# EAGLE design Picobot_10 (EAGLE 6.5.0)
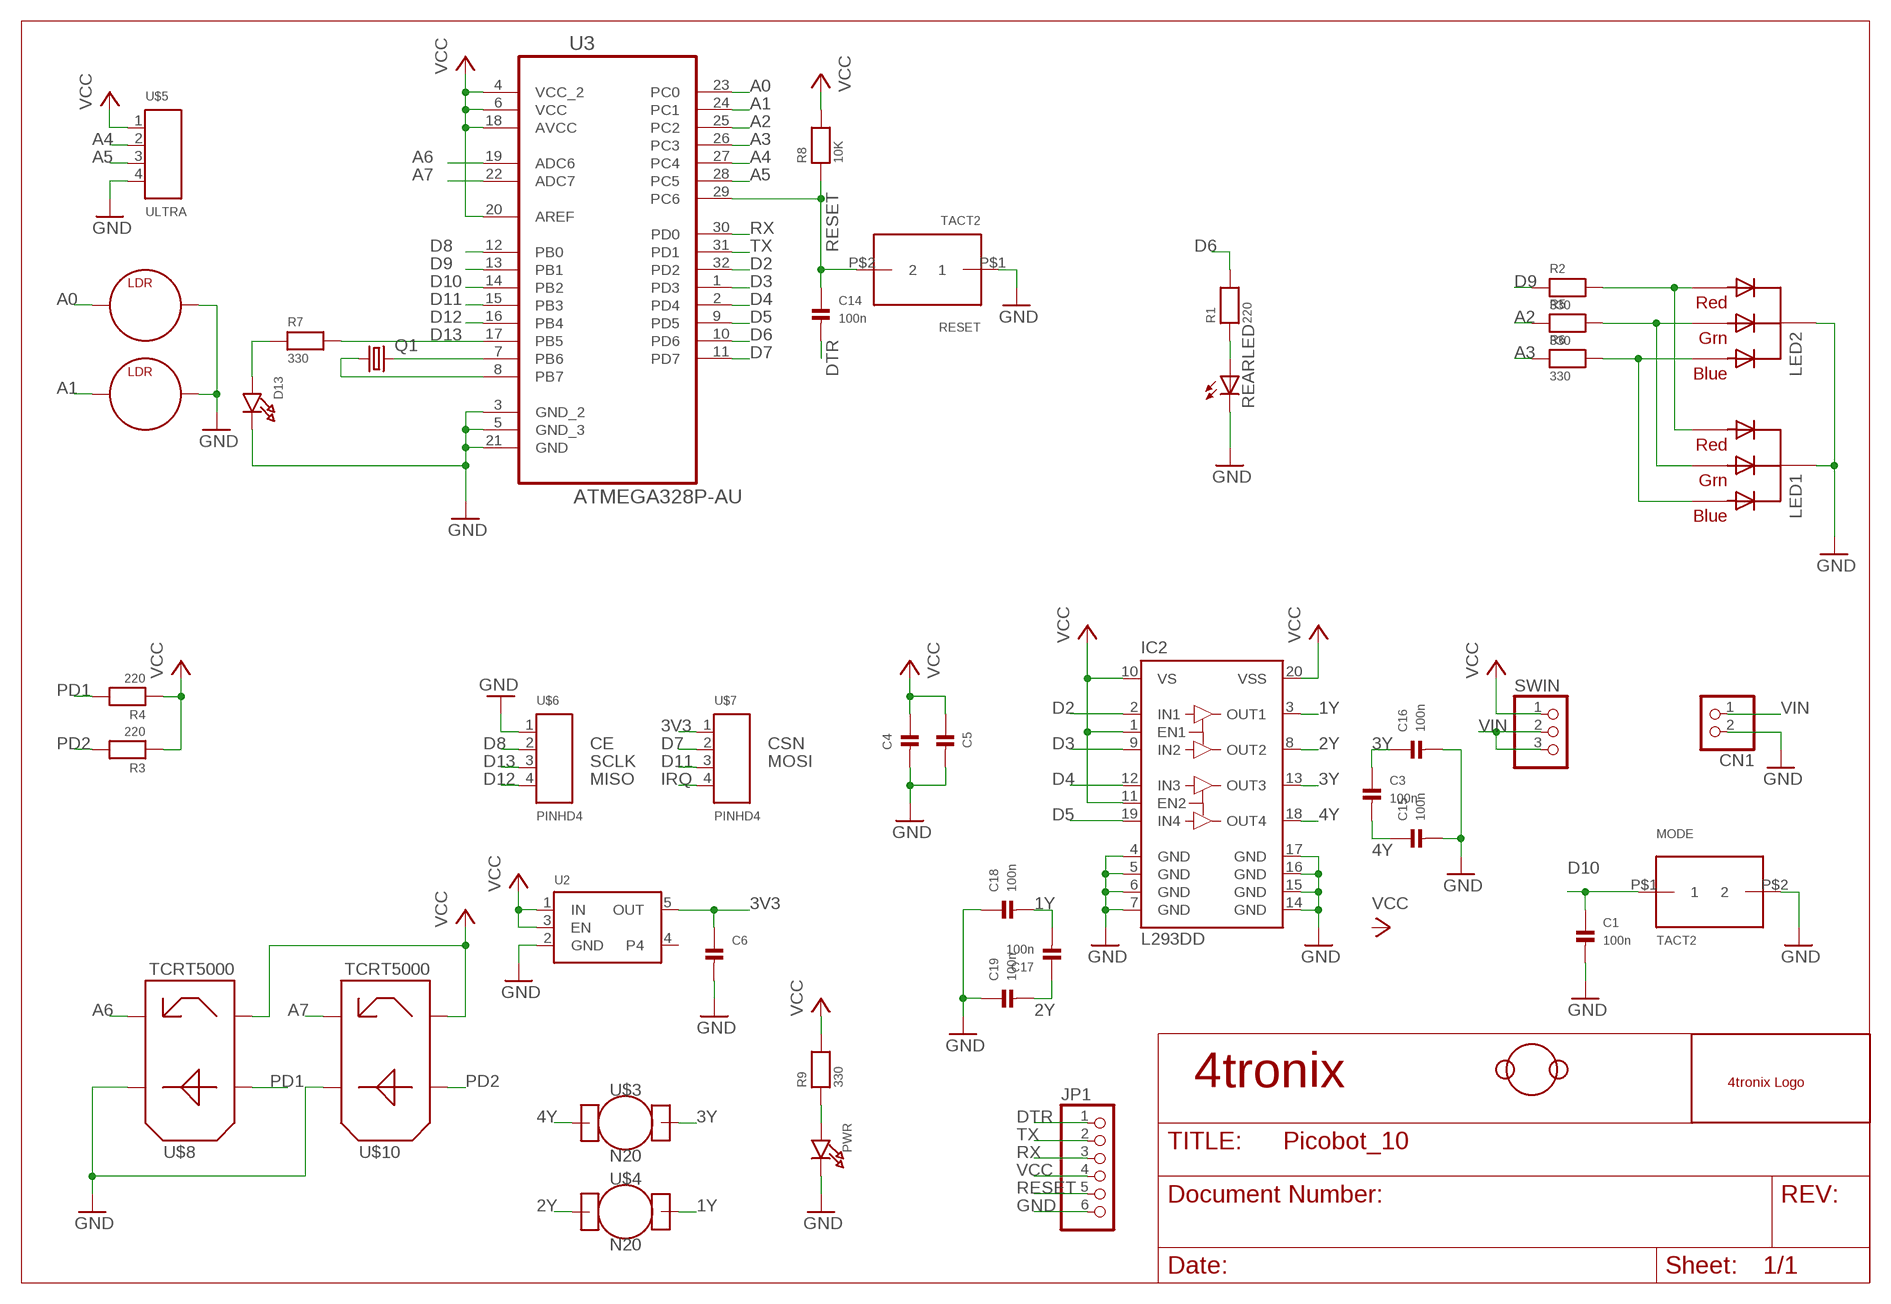
[diagram p0: schematic, sheet 1]

## Parts
C1  100n  CAP_CERAMIC_0805MP  [_0805MP]
C3  100n  CAP_CERAMIC_0805MP  [_0805MP]
C4  CAP_CERAMIC_0805MP  [_0805MP]
C5  CAP_CERAMIC_0805MP  [_0805MP]
C6  CAP_CERAMIC_0805MP  [_0805MP]
C14  100n  CAP_CERAMIC_0805MP  [_0805MP]
C15  100n  CAP_CERAMIC_0805MP  [_0805MP]
C16  100n  CAP_CERAMIC_0805MP  [_0805MP]
C17  100n  CAP_CERAMIC_0805MP  [_0805MP]
C18  100n  CAP_CERAMIC_0805MP  [_0805MP]
C19  100n  CAP_CERAMIC_0805MP  [_0805MP]
CN1  JST_2PIN-THM  [JST-PH-2-THM]
D13  LED0805_NOOUTLINE  [CHIPLED_0805_NOOUTLINE]
IC2  L293DD  [SO20]
JP1  PINHD-1X6CB  [1X06-CLEANBIG]
LDR1  LDR  [LDR]
LDR2  LDR  [LDR]
LED1  RGBLED_CA-5MM  [LED5MMRGB]
LED2  RGBLED_CA-5MM  [LED5MMRGB]
MODE  TACT2  [TACT2-PIN]
PWR  LED0805_NOOUTLINE  [CHIPLED_0805_NOOUTLINE]
Q1  CRYSTALHC49S  [HC49/S]
R1  220  RESISTOR0805_NOTHERMALS  [0805_NOTHERMALS]
R2  330  RESISTOR0805_NOTHERMALS  [0805_NOTHERMALS]
R3  220  RESISTOR0805_NOTHERMALS  [0805_NOTHERMALS]
R4  220  RESISTOR0805_NOTHERMALS  [0805_NOTHERMALS]
R5  330  RESISTOR0805_NOTHERMALS  [0805_NOTHERMALS]
R6  330  RESISTOR0805_NOTHERMALS  [0805_NOTHERMALS]
R7  330  RESISTOR0805_NOTHERMALS  [0805_NOTHERMALS]
R8  10K  RESISTOR0805_NOTHERMALS  [0805_NOTHERMALS]
R9  330  RESISTOR0805_NOTHERMALS  [0805_NOTHERMALS]
REARLED  LED3MM  [LED3MM]
RESET  TACT2  [TACT2-PIN]
SWIN  PINHD-1X3CB  [1X03-CLEANBIG]
U2  VREG_SOT23-5  [SOT23-5]
U3  ATMEGA328P-AU  [QFP80P900X900X120-32N]
U$2  LOGO  [LOGO]
U$3  N20  [N20]
U$4  N20  [N20]
U$5  ULTRA  PINHD4  [PINHD4]
U$6  PINHD4  [PINHD4]
U$7  PINHD4  [PINHD4]
U$8  TCRT5000  [TCRT5000]
U$9  DFRBALL  [DFRBALL]
U$10  TCRT5000  [TCRT5000]

## Nets
1Y: C17.2 C18.2 IC2.3(OUT1) U$4.MTRA(MTRB)
2Y: C17.1 C19.2 IC2.8(OUT2) U$4.MTRB(MTRA)
3V3: C6.1 U2.5(OUT) U$7.1
3Y: C3.1 C16.1 IC2.13(OUT3) U$3.MTRA(MTRB)
4Y: C3.2 C15.1 IC2.18(OUT4) U$3.MTRB(MTRA)
A0: LDR1.A U3.23(PC0)
A1: LDR2.A U3.24(PC1)
A2: R5.1 U3.25(PC2)
A3: R6.1 U3.26(PC3)
A4: U3.27(PC4) U$5.2
A5: U3.28(PC5) U$5.3
A6: U3.19(ADC6) U$8.TR2
A7: U3.22(ADC7) U$10.TR2
D2: IC2.2(IN1) U3.32(PD2)
D3: IC2.9(IN2) U3.1(PD3)
D4: IC2.12(IN3) U3.2(PD4)
D5: IC2.19(IN4) U3.9(PD5)
D6: R1.2 U3.10(PD6)
D7: U3.11(PD7) U$7.2
D8: U3.12(PB0) U$6.2
D9: R2.1 U3.13(PB1)
D10: C1.1 MODE.P$1 U3.14(PB2)
D11: U3.15(PB3) U$7.3
D12: U3.16(PB4) U$6.4
D13: R7.2 U3.17(PB5) U$6.3
DTR: C14.2 JP1.1
GND: C1.2 C4.2 C5.2 C6.2 C15.2 C16.2 C18.1 C19.1 CN1.2 D13.C IC2.4(GND) IC2.5(GND) IC2.6(GND) IC2.7(GND) IC2.14(GND) IC2.15(GND) IC2.16(GND) IC2.17(GND) JP1.6 LDR1.K LDR2.K LED1.2(VCC) LED2.2(VCC) MODE.P$2 PWR.C REARLED.K(C) RESET.P$1 U2.2(GND) U3.3(GND_2) U3.5(GND_3) U3.21(GND) U$5.4 U$6.1 U$8.LED2 U$10.LED2
IRQ: U$7.4
N$1: D13.A R7.1
N$2: R1.1 REARLED.A
N$3: LED1.1(RED) LED2.1(RED) R2.2
N$4: LED1.3(GREEN) LED2.3(GREEN) R5.2
N$5: LED1.4(BLUE) LED2.4(BLUE) R6.2
N$8: PWR.A R9.1
N$11: Q1.2 U3.7(PB6)
N$12: Q1.1 U3.8(PB7)
PD1: R4.2 U$8.LED1
PD2: R3.2 U$10.LED1
RESET: C14.1 JP1.5 R8.1 RESET.P$2 U3.29(PC6)
RX: JP1.3 U3.30(PD0)
TX: JP1.2 U3.31(PD1)
VCC: C4.1 C5.1 IC2.1(EN1) IC2.10(VS) IC2.11(EN2) IC2.20(VSS) JP1.4 R3.1 R4.1 R8.2 R9.2 SWIN.1 U2.1(IN) U2.3(EN) U3.4(VCC_2) U3.6(VCC) U3.18(AVCC) U3.20(AREF) U$5.1 U$8.TR1 U$10.TR1
VIN: CN1.1 SWIN.2 SWIN.3
Unconnected: U2.4

## Notes on the sheet
- CE | CSN
- SCLK | MOSI
- MISO
- 4tronix

## Library data of the parts
C1 C3-C6 C14-C19 = microbuilder:CAP_CERAMIC: Ceramic Capacitors 0402 - 0402 Surface Mount Capacitors 16pF 50V 5% [Digikey: 445-4899-2-ND] 18pF 50V 5% [Digikey: 490-1281-2-ND] 22pF 50V 5% [Digikey: 490-1283-2-ND] 68pF 50V 5% [Digikey: 490-1289-2-ND] 0.1uF 10V 10% [Digikey: 490-1318-2-ND] 1.0uF 6.3V 10% [Digikey: 490-1320-2-ND] 0603 - 0603 Surface Mount Capacitors 16 pF 50V 5% [Digikey: 445-5051-2-ND] 22 pF 50V [Digikey: PCC220ACVTR-ND] 33 pF 50V 5% [Digikey: 490-1415-1-ND] 56pF 50V 5% [Digikey: 490-1421-1-ND] 220pF 50V 5% [Digikey: 445-1285-1-ND] 680 pF 50V 2200 pF 50V 5% C0G [Digikey: 445-1297-1-ND] 5600 pF 100V 5% X7R [Digikey: 478-3711-1-ND] 0.1 µF 25V 10% [Digikey: PCC2277TR-ND] 0.22 µF 16V 10% X7R [Digikey: 445-1318-1-ND] 1.0 µF 25V 10% [Digikey: 445-5146-2-ND] 0603 - RF Specific 3pF 250V +/-0.1pF RF [Digikey: 712-1347-1-ND] 18 pF 250V 5% [Digikey: 478-3505-1-ND or 712-1322-1-ND] 56 pF 250V 5% C0G RF [Digikey: 490-4867-1-ND] 68 pF 250V RF [Digikey: 490-4868-1-ND] 0805 - 0805 Surface Mount Capacitors 220 pF 250V 2% RF Ceramic Capacitor [Digikey: 712-1398-1-ND] 1000 pF 50V 2% NP0 Ceramic Capacitor [Digikey: 478-3760-1-ND] 0.1 µF 25V 10% Ceramic Capacitor [Digikey: PCC1828TR-ND] 1.0 µF 16V 10% Ceramic Capacitor[Digikey: 490-1691-2-ND] 10.0 µF 10V 10% Ceramic Capacitor[Digikey: 709-1228-1-ND] 10.0 uF 16V 10% Ceramic Capacitor [Digikey: 478-5165-2-ND] 47 uF 6.3V 20% Ceramic Capacitor [Digikey: 587-1779-1-ND or 399-5506-1-ND] 1206 - 1206 Surface Mount Capacitors 47uF 10V 20% Ceramic Capacitor [Digikey: 490-5528-1-ND or 399-5508-1-ND or 445-6010-1-ND] 100uF 6.3V -20%, +80% Y5V Ceramic Capacitor (Digikey: 490-4512-1-ND, Mouser: 81-GRM31CF50J107ZE1L)
CN1 = adafruit:JST_2PIN: JST 2-Pin Connectors of various flavors SMT-RA (S2B-PH-SM4) 4UConnector #17311 SMT (B2B-PH-SM4) THM-RA (S2B-PH) THM (B2B-PH)
D13 PWR = microbuilder:LED: LED
IC2 = st-microelectronics:L293DD: PUSH-PULL FOUR CHANNEL DRIVER WITH DIODES Source: http://www.st.com/stonline/books/pdf/docs/1330.pdf; OC_FARNELL: unknown
JP1 = adafruit:PINHD-1X6: PIN HEADER
LDR1 LDR2 = 4tronix:LDR
LED1 LED2 = 4tronix:RGBLED_CA: RGB LED, common-anode 5MM Staggered pins 5mm Piranha package http://www.ladyada.net/library/pcb/eaglelibrary.html
MODE RESET = 4tronix:TACT2
Q1 = crystal:CRYSTAL: CRYSTAL; OC_FARNELL: 1667008; OC_NEWARK: unknown
R1-R9 = microbuilder:RESISTOR: Resistors 0402 - 0402 Surface Mount Package 22 Ohm 1% 1/16W [Digikey: 311-22.0LRTR-ND] 33 Ohm 5% 1/16W 1.0K 5% 1/16W 1.5K 5% 1/16W 2.0K 1% 1/16W 10.0K 1% 1/16W [Digikey: 311-10.0KLRTR-ND] 10.0K 5% 1/16W [Digikey: RMCF0402JT10K0TR-ND] 12.1K 1% 1/16W [Digikey: 311-22.0LRTR-ND] 100.0K 5% 1/16W 0603 - 0603 Surface Mount Package 0 Ohm 1/10 Watt 1% Resistor 15 Ohm 1/10 Watt 1% Resistor 33 Ohm 1/10 Watt 1% Resistor 49.9 Ohm 1/10 Watt 1% Resistor 100 Ohm 1/10 Watt 1% Resistor 150 Ohm 1/10 Watt 1% Resistor 240 Ohm 1/10 Watt 1% Resistor 390 Ohm 1/10 Watt 1% Resistor 560 Ohm 1/10 Watt 1% Resistor 680 Ohm 1/10 Watt 1% Resistor 750 Ohm 1/10 Watt 1% Resistor 1.0K Ohm 1/10 Watt 1% Resistor 1.5K Ohm 1/10 Watt 1% Resistor 2.0K Ohm 1/10 Watt 1% Resistor 2.2K Ohm 1/10 Watt 1% Resistor 3.3K Ohm 1/10 Watt 1% Resistor 4.7K Ohm 1/10 Watt 1% Resistor 10.0K Ohm 1/10 Watt 1% Resistor 12.0K Ohm 1/10 Watt 1% Resistor 12.1K Ohm 1/10 Watt 1% Resistor 20.0K Ohm 1/10 Watt 1% Resistor 33.0K Ohm 1/10 Watt 1% Resistor 100.0K Ohm 1/10 Watt 1% Resistor 0805 - 0805 Surface Mount Package 0 Ohm 1/8 Watt 1% Resistor 33 Ohm 1/8 Watt 1% Resistor 100 Ohm 1/8 Watt 1% Resistor 150 Ohm 1/8 Watt 1% Resistor 200 Ohm 1/8 Watt 1% Resistor 240 Ohm 1/8 Watt 1% Resistor 330 Ohm 1/8 Watt 1% Resistor 390 Ohm 1/8 Watt 1% Resistor 470 Ohm 1/8 Watt 1% Resistor 1.0K Ohm 1/8 Watt 1% Resistor 1.5K Ohm 1/8 Watt 1% Resistor 2.0K Ohm 1/8 Watt 1% Resistor 4.7K Ohm 1/8 Watt 1% Resistor 5.1K Ohm 1/8 Watt 1% Resistor 5.6K Ohm 1/8 Watt 1% Resistor 10.0K Ohm 1/8 Watt 1% Resistor 22.0K Ohm 1/8 Watt 1% Resistor 33.0K Ohm 1/8 Watt 1% Resistor 100K Ohm 1/8 Watt 1% Resistor 1206 - 1206 Surface Mount Package 2012 - 2010 Surface Mount Package 0.11 Ohm 1/2 Watt 1% Resistor - Digikey: RHM.11UCT-ND
REARLED = adafruit:LED: LED
SWIN = adafruit:PINHD-1X3: PIN HEADER
U2 = microbuilder:VREG_SOT23-5: SOT23-5 Fixed Voltage Regulators To better organise some of the SOT23-5 fixed voltage regulators in this library, this new part was created. Part Current Out V Out V In V Dropout Digikey Part No. ADP121 150mA 3.3V 3.4-5.5V 0.09V @ 150mA ADP121-AUJZ33R7CT-ND ADP121 150mA 3.0V 3.1-5.5V 0.09V @ 150mA ADP121-AUJZ30R7CT-ND ADP122 300mA 3.3V 3.4-5.5V 0.085V @ 300mA ADP122AUJZ-3.3-R7CT-ND ADP1712 300mA 3.3V 3.5-5.5V 0.17V @ 300mA ADP1712AUJZ-3.3-R7TR-ND AP7311 (Low Cost) 150mA 3.3V 3.5-6V 0.15V @ 150mA AP7311-33WG-7DICT-ND LD39015M18R 150mA 1.8V 1.9V-5.5V 0.08V @ 100mA 497-6977-1-ND MCP1824T-3302E/OT 300mA 3.3V 3.5V-6V 0.2V @ 300mA MCP1824T-3302E/OTCT-ND MIC5205-2.5YM5 TR 150mA 2.5V 2.7-16V 0.165V @ 150mA 576-1257-2-ND MIC5205-3.0YM5 TR 150mA 3.0V 3.2V-16V 0.165V @ 150mA 576-1258-2-ND MIC5205-3.3YM5 TR 150mA 3.3V 3.5V-16V 0.165V @ 150mA 576-1259-2-ND TPS780330220 150mA 3.3V+2.2V 3.6-5.5V 250mV Max 296-23332-1-ND TDA3663/N1,135 100mA 3.3V 3.5-45V 0.18V @ 50mA 568-5343-1-ND
U3 = Atmel_By_element14_Batch_1-00:ATMEGA328P-AU: 8-bit Microcontroller with In-System Programmable Flash; MPN: ATMEGA328P-AU; OC_FARNELL: 1715486; OC_NEWARK: 14R4631; PACKAGE: TQFP-32; SUPPLIER: Atmel
U$2 = 4tronix:LOGO
U$3 U$4 = 4tronix:N20
U$5-U$7 = 4tronix:PINHD4
U$8 U$10 = 4tronix:TCRT5000
U$9 = 4tronix:DFRBALL

## Board
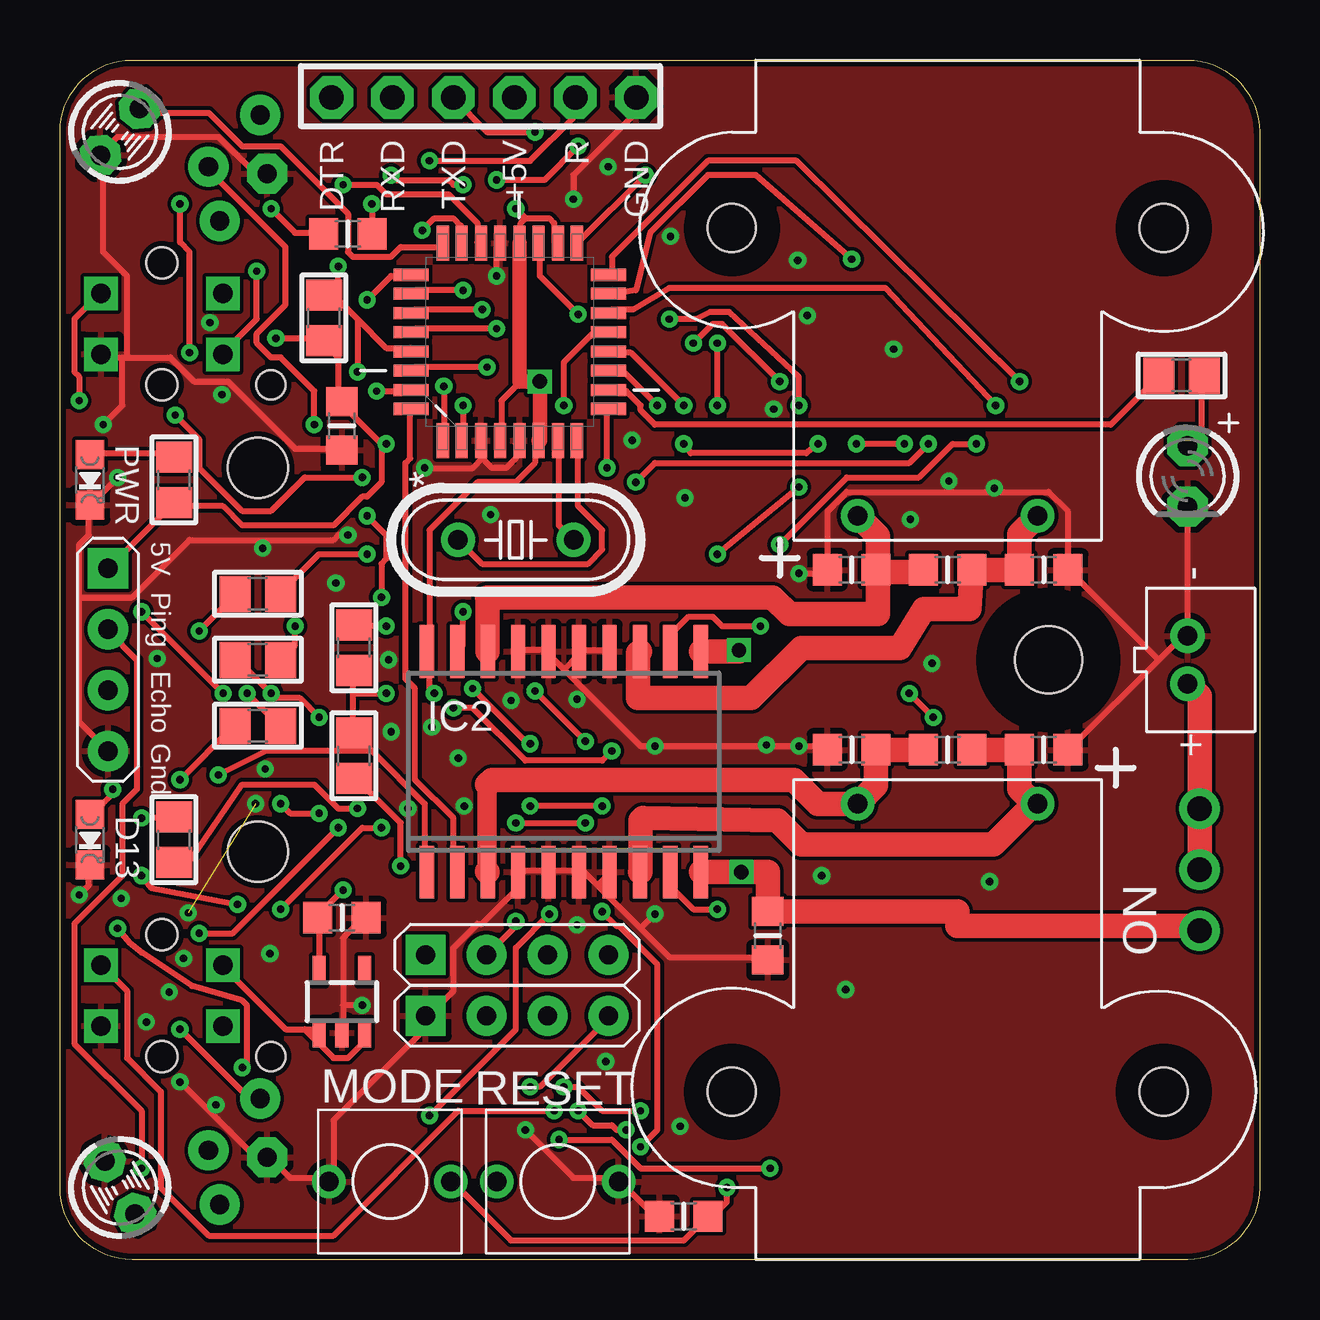
[diagram p1: board, top side]
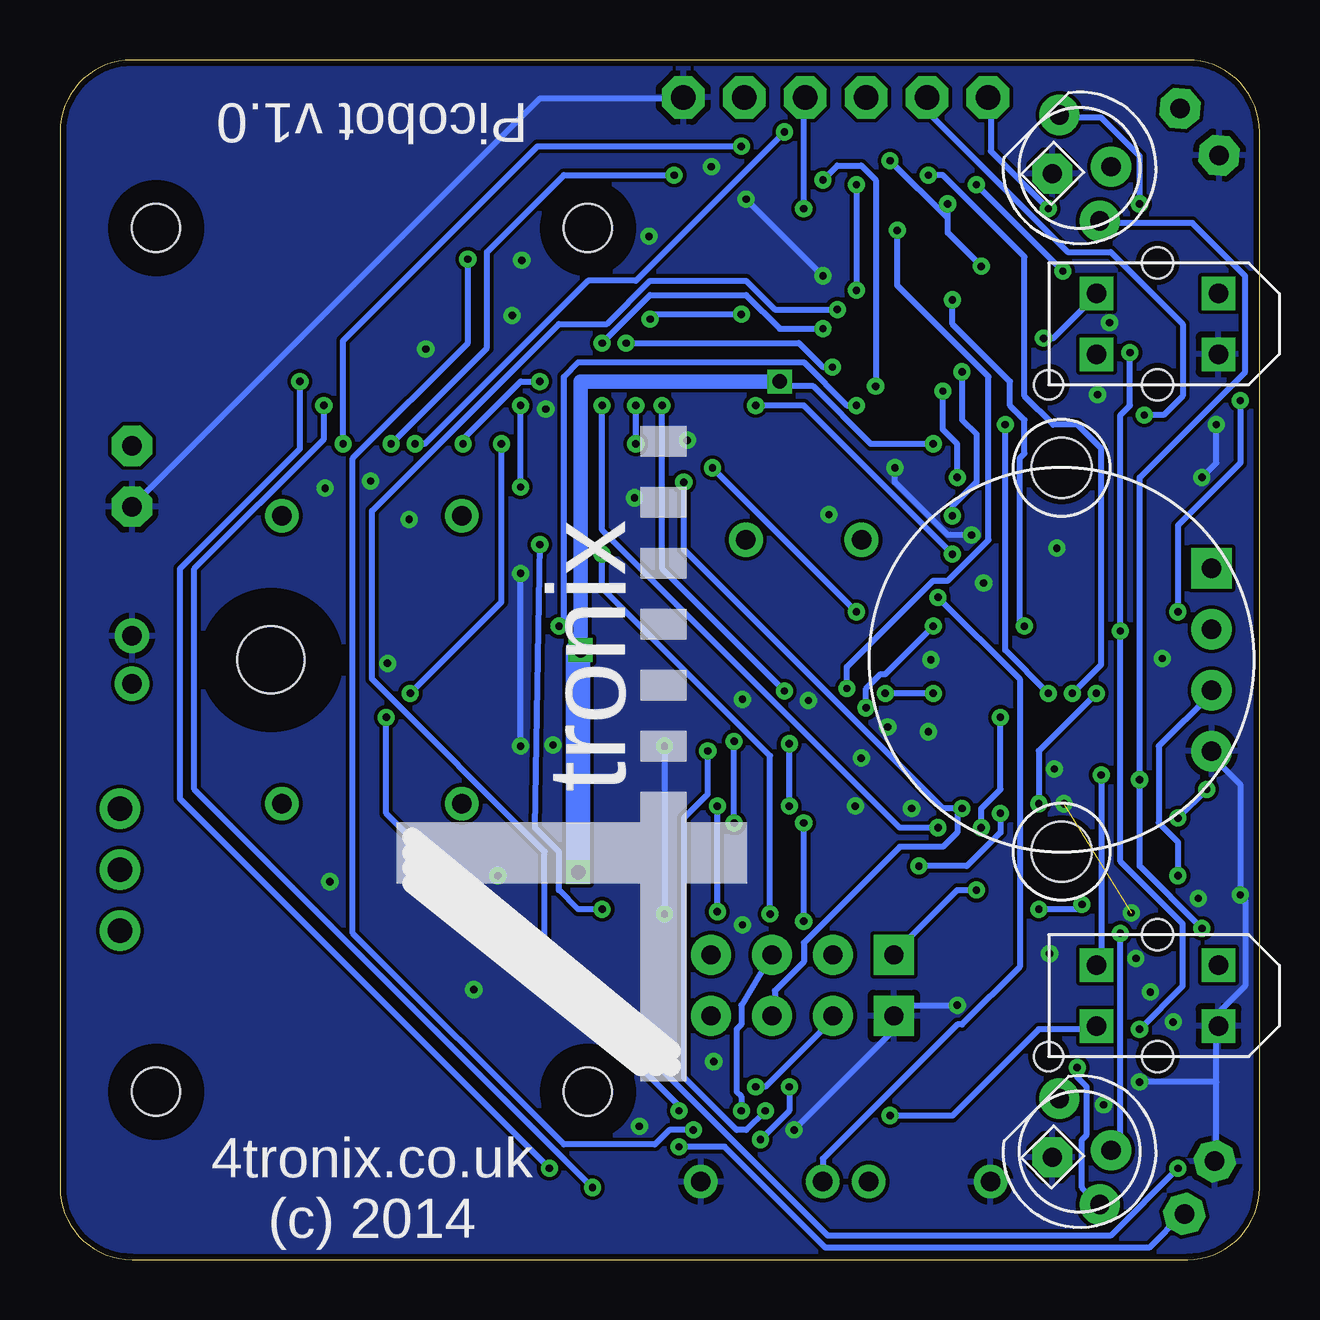
[diagram p2: board, bottom side, seen from below]

Size 50 x 50 mm. Coordinates in mm from the lower left corner, seen from the top.
Outline: 0,3 0,47 arc-90 3,50 47,50 arc-90 50,47 50,3 arc-90 47,0 3,0 arc-90 0,3
Copper layers (1*16): Top 0.035mm / dielectric 1.5mm / Bottom 0.035mm
Design rules "DFRobot_Eagle_Rule_v0.4 *": minimum track width 10mil, minimum drill 12mil, track to track 6mil, track to pad 6mil, pad to pad 6mil, via to via 6mil, smd to smd 0mil, copper to edge 10mil, drill to drill 10mil, minimum pad ring 12mil, minimum via ring 8mil, stop-mask expansion 2mil, vias tented up to drill 25mil, thermal gap 10mil
Holes 2.8 mm at 41.2,25
tRestrict: area 39.2,23 to 43.2,27
bRestrict: area 39.2,23 to 43.2,27

### Footprints (pad centres in the part's own frame; a part is rotated, then mirrored left to right if it is on the bottom)
_0805MP = smd 1.2 x 1.3: 1 -1.016,0; 2 1.016,0
JST-PH-2-THM = drill 0.8 pad 1.422: 1 1,0; 2 -1,0
CHIPLED_0805_NOOUTLINE = smd 1.2 x 1.2: A 0,-1.05; C 0,1.05
SO20 = smd 0.6 x 2.2: 1 -5.715,-4.6; 2 -4.445,-4.6; 3 -3.175,-4.6; 4 -1.905,-4.6; 5 -0.635,-4.6; 6 0.635,-4.6; 7 1.905,-4.6; 8 3.175,-4.6; 9 4.445,-4.6; 10 5.715,-4.6; 11 5.715,4.6; 12 4.445,4.6; 13 3.175,4.6; 14 1.905,4.6; 15 0.635,4.6; 16 -0.635,4.6; 17 -1.905,4.6; 18 -3.175,4.6; 19 -4.445,4.6; 20 -5.715,4.6
1X06-CLEANBIG = drill 1.016 pad 1.778 octagon: 1 -6.35,0; 2 -3.81,0; 3 -1.27,0; 4 1.27,0; 5 3.81,0; 6 6.35,0
LDR = drill 0.813 pad 1.676 octagon: A -1.27,0; K 1.27,0
LED5MMRGB = drill 0.8 pad 1.676: 1 -2.159,0.968; 3 0.889,0.968; 4 2.159,-0.968 | drill 0.8 pad 1.676 octagon: 2 -0.635,-0.968
TACT2-PIN = drill 0.8: P$1 -2.54,0; P$2 2.54,0
HC49/S = drill 0.813: 1 -2.413,0; 2 2.413,0
0805_NOTHERMALS = smd 1.3 x 1.5: 1 -0.95,0; 2 0.95,0
LED3MM = drill 0.813 pad 1.676 octagon: A -1.27,0; K 1.27,0
1X03-CLEANBIG = drill 1.016 pad 1.676: 1 -2.54,0; 2 0,0; 3 2.54,0
SOT23-5 = smd 0.55 x 1.2: 1 -0.95,-1.3; 2 0,-1.3; 3 0.95,-1.3; 4 0.95,1.3; 5 -0.95,1.3
QFP80P900X900X120-32N = smd 1.473 x 0.508: 1 -4.115,2.794; 2 -4.115,2.007; 3 -4.115,1.194; 4 -4.115,0.406; 5 -4.115,-0.406; 6 -4.115,-1.194; 7 -4.115,-2.007; 8 -4.115,-2.794; 17 4.115,-2.794; 18 4.115,-2.007; 19 4.115,-1.194; 20 4.115,-0.406; 21 4.115,0.406; 22 4.115,1.194; 23 4.115,2.007; 24 4.115,2.794 | smd 0.508 x 1.473: 9 -2.794,-4.115; 10 -2.007,-4.115; 11 -1.194,-4.115; 12 -0.406,-4.115; 13 0.406,-4.115; 14 1.194,-4.115; 15 2.007,-4.115; 16 2.794,-4.115; 25 2.794,4.115; 26 2.007,4.115; 27 1.194,4.115; 28 0.406,4.115; 29 -0.406,4.115; 30 -1.194,4.115; 31 -2.007,4.115; 32 -2.794,4.115
N20 = drill 0.8: MTRA 3.75,-12; MTRB -3.75,-12 | hole 2: -9,0; 9,0
PINHD4 = drill 0.8 pad 1.676 square: 1 0,3.81 | drill 0.8 pad 1.676: 2 0,1.27; 3 0,-1.27; 4 0,-3.81
TCRT5000 = drill 0.8 square: LED1 2.54,1.27; LED2 2.54,-1.27; TR1 -2.54,1.27; TR2 -2.54,-1.27 | hole 1.3: 0,2.54; 0,-2.54 | hole 1.2: -4.54,-2.54
DFRBALL = hole 2.5: -8,0; 8,0

### Placement (x,y rotation side)
C1  26,1.8 180 top
C3  37,28.75 180 top
C4  29.5,13.5 270 top
C5  11.75,34.75 270 top
C6  11.75,14.25 0 top
C14  12,42.75 180 top
C15  33,28.75 180 top
C16  41,28.75 0 top
C17  37,21.25 180 top
C18  33,21.25 0 top
C19  41,21.25 180 top
CN1  47,25 270 top
D13  1.25,17.5 180 top
IC2  21,20.75 0 top
JP1  17.67,48.44 0 top
LDR1  2.5,3 120 top
LDR2  2.5,47 230 top
LED1  7.5,4.5 315 bottom
LED2  7.5,45.5 315 bottom
MODE  13.75,3.25 180 top
PWR  1.25,32.5 180 top
Q1  19,30 0 top
R1  46.75,36.85 180 top
R2  8.25,27.75 180 top
R3  12.25,21 270 top
R4  12.25,25.5 90 top
R5  8.25,25 180 top
R6  8.25,22.25 180 top
R7  4.75,17.5 270 top
R8  11,39.25 270 top
R9  4.75,32.5 270 top
REARLED  47,32.65 270 top
RESET  20.75,3.25 180 top
SWIN  47.5,16.25 90 top
U2  11.75,10.75 0 top
U3  18.75,38.25 90 top
U$2  25.8,23.3 90 bottom
U$3  37,43 0 top
U$4  37,7 180 top
U$5  2,25 0 top
U$6  19.05,10.16 90 top
U$7  19.05,12.7 90 top
U$8  4.25,11 0 bottom
U$9  8.25,25 90 bottom
U$10  4.25,39 0 bottom

### Tracks (layer width: path | path; a pad name or v marks a point on that pad's centre or on a via)
1Y
  Top 0.813: 17.8,16.18 17.8,19.8
  Top 1.016: IC2.3 17.8,16.18 | 17.8,19.8 18,20 30.6,20 31.6,19 U$4.MTRA 34.02,19.77 C18.2 C17.2
2Y
  Top 1.016: IC2.8 24.2,16.15 24.2,18.3 24.3,18.4 29.9,18.3 30.9,17.3 38.9,17.3 40.6,19 | 40.6,19 U$4.MTRB | 40.6,19 39.98,19.62 C19.2 C17.1
3V3  (via drill 0.3)
  Top 0.254: U2.5 10.8,14.2 C6.1 10.8,14.4 v11.8,15.4
  Bottom 0.254: v11.8,15.4 12.6,15.4 15.2,12.8 U$7.1
3Y
  Top 1.016: IC2.13 24.1,25.27 24.1,23.4 28.8,23.4 30.9,25.5 35,25.5 36,27.12 37.92,27.12 C3.1 C16.1 39.98,30.23 U$3.MTRA
4Y
  Top 1.016: IC2.18 17.82,27.57 17.8,27.6 29.7,27.6 30.4,26.9 34.1,26.9 34.1,28.67 | 34.1,28.67 C15.1 | 34.1,28.67 34.1,30.15 U$3.MTRB | 34.1,28.67 35.9,28.67 C3.2
A0  (via drill 0.3)
  Top 0.254: v15.1,42.9 15.6,43.4 16.4,43.4 16.7,43.1 16.7,42.4 U3.23 | v17.2,23.8 19.5,21.5 v19.6,21.5 | v22.6,18.9 v19.6,18.9 | v22.6,14.5 23.2,13.9 23.3,13.9 24.9,12.3 24.9,5.4 v24.2,4.7
  Bottom 0.254: v15.1,42.9 15.1,40.6 11.3,36.8 11.3,30 13,28.3 13.6,28.3 17.2,24.7 v17.2,23.8 | v19.6,18.9 v19.6,21.5 | v22.6,14.5 v22.6,18.9 | v24.2,4.7 22.3,4.7 18.1,0.5 4.6,0.5 3.2,1.9 LDR1.A
A1
  Top 0.254: U3.24 15.8,42.2 14.2,42.2 13.8,41.8 12.2,41.8 12,42 12,43.6 9.2,46.4 7.6,46.4 6.2,47.8 3.4,47.8 LDR2.A
A2  (via drill 0.3)
  Top 0.254: v12.8,40 13.8,41 14.6,41 U3.25 | v9.8,26.4 9.8,25.6 R5.1
  Bottom 0.254: v12.8,40 12.8,39 10.4,36.6 10.4,35.6 9.8,35 9.8,33.6 10,33.4 10,26.6 v9.8,26.4
A3  (via drill 0.3)
  Top 0.254: v16.8,40.4 14.8,40.4 U3.26 | v16.8,44.8 16.4,44.8 16.2,45 14,45 v13.8,45.2 | v7.8,23.6 9.2,22.2 R6.1
  Bottom 0.254: v16.8,44.8 v16.8,40.4 | v13.8,45.2 13.2,45.2 9.8,41.8 9.8,36 8.6,34.8 7.6,34.8 6.6,33.8 6.6,24.8 v7.8,23.6
A4  (via drill 0.3)
  Top 0.254: v17.6,39.6 14.8,39.6 U3.27 | v3.4,3.8 3.4,6.2 0.6,9 0.6,14 2.6,16 2.6,19 3.2,19.6 3.2,25 2,26.2 U$5.2
  Bottom 0.254: v17.6,39.6 20.2,39.6 21.4,40.8 25.4,40.8 27.2,39 29.2,39 37,31.2 37,24.2 29.8,17 29.8,12.8 18,1 6.2,1 v3.4,3.8
A5  (via drill 0.3)
  Top 0.254: v18.2,38.8 14.8,38.8 U3.28 | v27.4,35.6 v27.4,38.2 | v13.4,18 12.6,18 v9.2,14.6 | v7.4,14.8 3.8,15.5 v3.4,16
  Bottom 0.254: v18.2,38.8 20,38.8 21.4,40.2 25.4,40.2 v27.4,38.2 | v27.4,35.6 27.4,30.4 15,18 v13.4,18 | v9.2,14.6 7.6,14.6 v7.4,14.8 | v3.4,16 3.4,17.4 4.2,18.2 4.2,21.4 2,23.6 U$5.3
A6  (via drill 0.3)
  Top 0.254: v21.6,39.4 20,41 20,42.2 U3.19 | v25.4,39.2 26.5,39.2 27.1,39.5 27.9,39.5 30.8,36.8 v30.8,35.6 | v27.4,29.4 v30.8,32.2 | v20.4,14.4 19,13 19,9.6 v15.4,6
  Bottom 0.254: v21.6,39.4 25.2,39.4 v25.4,39.2 | v30.8,32.2 v30.8,35.6 | v27.4,29.4 27.4,28 20.4,21 v20.4,14.4 | v15.4,6 12.8,6 9.2,9.6 6.8,9.6 U$8.TR2
A7  (via drill 0.3)
  Top 0.254: v11.8,44.8 13.2,44.8 13.6,44.4 16.2,44.4 17.4,43.2 17.4,42.4 U3.22 | v8.2,41.2 8.2,39.2 6.8,37.8 U$10.TR2
  Bottom 0.254: v8.2,41.2 v11.8,44.8
D2
  Top 0.254: U3.32 14.6,35.4 14.6,33.4 14.4,33.2 14.4,24.2 14.8,23.8 14.8,20 16.4,18.4 16.4,16.2 IC2.2
D3  (via drill 0.3)
  Top 0.254: v16,36.4 16,34.2 U3.1 | v18.2,45 20.2,45 v21.6,46.4 | v38.2,34 37.2,34 35.8,32.6 32.8,32.6 v30,29.8 | v27.4,14.6 26.4,14.6 25.6,15.4 25.6,16 IC2.9
  Bottom 0.254: v16,36.4 16,45 16.6,45.6 17.6,45.6 v18.2,45 | v21.6,46.4 30.1,46.4 38.2,38.3 v38.2,34 | v30,29.8 30.2,18 29.2,17 29.2,15.4 28.4,14.6 v27.4,14.6
D4  (via drill 0.3)
  Top 0.254: v16.8,35.6 16.8,34.2 U3.2 | v29.2,26.4 27.6,26.4 27.2,26.8 26.2,26.8 25.6,26.2 25.6,25.4 IC2.12
  Bottom 0.254: v16.8,35.6 17.2,35.6 19,37.4 28.4,37.4 29,36.8 29,26.6 v29.2,26.4
D5  (via drill 0.3)
  Top 0.254: v22.8,33 22.8,35.4 U3.9 | v16.8,27 16.8,25.6 16.6,25.4 IC2.19
  Bottom 0.254: v16.8,27 v22.8,33
D6
  Top 0.254: U3.10 23,36.2 23.6,36.2 24.2,35.6 24.2,35.4 24.8,34.8 43.8,34.8 45.8,36.8 R1.2
D7  (via drill 0.3)
  Top 0.254: v24.9,35.6 23.5,37 22.9,37 U3.11 | v21.9,21.6 v19.8,23.7 | v19,18.2 v21.9,18.2 | v19,14.1 19,13.9 17.8,12.7 U$7.2
  Bottom 0.254: v24.9,35.6 24.9,28.8 v19.8,23.7 | v21.9,18.2 v21.9,21.6 | v19,14.1 v19,18.2
D8  (via drill 0.3)
  Top 0.254: v26,35.6 23.8,37.8 23,37.8 U3.12 | v31.6,34 31.1,33.61 26.3,33.61 v26,34 | v36.4,22.6 v35.4,23.6 | v24.2,6.2 22.6,6.2 21.6,7.2 v21,7.2
  Bottom 0.254: v26,34 v26,35.6 | v31.6,34 31.6,27.4 v35.4,23.6 | v36.4,22.6 36.4,18.6 24.2,6.4 v24.2,6.2 | v21,7.2 20.6,7.2 17.8,10 U$6.2
D9  (via drill 0.3)
  Top 0.254: v21,35.6 21,37.4 22.2,38.6 22.8,38.6 U3.13 | v12.8,29.4 10.8,29.4 9.2,27.8 R2.1
  Bottom 0.254: v21,35.6 19,35.6 v12.8,29.4
D10  (via drill 0.3)
  Top 0.254: MODE.P$1 16.4,3.2 18.8,0.8 26,0.8 27,1.8 C1.1 27.2,1.8 27.8,2.4 v27.8,3 | v39,35.6 34.4,40.5 25.4,40.5 23.9,39.6 23,39.6 U3.14
  Bottom 0.254: v39,35.6 39,34.2 44.4,28.8 44.4,19.6 v27.8,3
D11  (via drill 0.3)
  Top 0.254: v33,41.7 29,45.2 27,45.2 24.6,42.8 24,40.4 23.4,40.3 23,40.4 U3.15 | v23.6,5.4 23.2,5.4 23,5.6 22.2,5.6 v21.6,6.2
  Bottom 0.254: v33,41.7 33,38.2 37.8,33.4 37.8,13.6 29,4.8 25.2,4.8 24.6,5.4 v23.6,5.4 | v21.6,6.2 21.6,6.8 21.8,7 21.8,9.6 21.6,9.8 21.6,10.6 20.4,12.6 U$7.3
D12  (via drill 0.3)
  Top 0.254: v40,36.6 30.7,45.8 27,45.8 23,41.8 23,41.2 U3.16 | v29.6,3.8 24.2,3.8 23,5 v20.8,5 | v19.6,7.2 20,7.2 22.8,10 U$6.4
  Bottom 0.254: v40,36.6 40,33.8 45,28.8 45,19.2 v29.6,3.8 | v20.8,5 19.6,6.2 v19.6,7.2
D13  (via drill 0.3)
  Top 0.254: v24.4,45.2 21.6,42.4 U3.17 | v36.2,34 35.4,33.2 24.8,33.2 v24,32.4 | v12.4,18.8 11.6,18.8 10.6,19.8 7.6,19.8 5.4,16.6 4.8,16.6 R7.2
  Bottom 0.254: v24.4,45.2 29,45.2 32.2,42 32.2,38 v36.2,34 | v24,32.4 24,29.6 13.2,18.8 12.6,18.8 | 12.6,18.8 12.6,17.8 13.2,17.2 15,17.2 19,13.2 19,12.4 20.2,11.2 20.2,10.2 U$6.3 | 12.6,18.8 v12.4,18.8
DTR  (via drill 0.3)
  Top 0.254: v8.8,43.8 9.8,42.8 10.8,42.8 C14.2
  Bottom 0.254: v8.8,43.8 11.2,46.2 11.2,48.4 JP1.1
GND  (via drill 0.3)  (1 unrouted)
  Top 0.254: v18.2,41 18.2,42.2 U3.21 | v21.4,44.2 21.4,45.2 24,47.8 24,48.4 JP1.6 | 45.8,25 46.8,26 CN1.2 REARLED.K | 45.8,25 42.2,21.4 C19.1 | 45.8,25 42.2,28.6 C16.2 42,28.8 42,31.2 41.2,32 32.8,32 32,31.2 32,28.8 C15.2 31.8,28.6 v30.8,28.6 | 19,16.2 IC2.4 | IC2.4 19.2,16.2 20.2,16.2 IC2.5 20.4,16.2 21.6,16.2 IC2.6 21.8,16.2 22.4,15.6 | 23,16.2 IC2.7 22.8,16 22.4,15.6 | 22.4,15.6 24.2,13.8 | 24.2,13.8 25.4,12.6 29.4,12.6 C4.2 | 23,25.4 IC2.14 22.8,25.4 21.8,25.4 IC2.15 | 21.6,25.4 IC2.15 | 19,25.4 IC2.17 19.2,25.4 20.2,25.4 IC2.16 | 21,24.6 20.4,25.2 IC2.16 | 21,24.6 24.2,21.4 v24.8,21.4 v30.8,21.4 31.8,21.4 C18.1 | 20.4,25.4 IC2.16 | 21,24.6 21.6,25.2 IC2.15 | v24.8,14.4 24.2,13.8 | 11.8,10.6 11.8,13.4 12.6,14.2 C6.2 | 11.8,10.6 11.8,9.6 U2.2 | C1.2 24.8,1.8 23.4,3.2 RESET.P$1 23.2,3.4 21.4,3.4 v19.4,5.4 | v12.6,10.6 11.8,10.6 | IC2.4 19,16 19,15.4 17.6,14 17.4,14 16.4,13 16.4,11.2 15.4,10.2 U$6.1 15.2,10 15.2,9.6 11.4,5.8 11.4,3.4 MODE.P$2 11.2,3.4 9.6,3.4 8.8,4.2 LED1.2 8.6,4.4 8,4.4 v5,7.4 | 2.6,37.6 1.8,37.6 U$10.LED2 | 2.6,37.6 2.8,37.6 | 2.8,37.6 4.6,37.6 5.6,36.6 7,36.6 9.8,33.8 11.6,33.8 C5.2 | 2.8,37.6 2.8,41 1.8,42 1.8,46 LDR2.K 1.8,46.2 2.4,46.8 6.6,46.8 8,45.4 8.6,45.4 LED2.2 | 17.6,33.4 17.6,34 U3.3 17.6,33.4 | 17.6,33.4 18,33 18.6,33 19,33.4 19,34 U3.5 | v0.8,15.2 1.2,15.6 1.2,16.4 D13.C | 0.8,27.6 0.8,22.4 U$5.4 | 0.8,27.6 0.8,29.8 1.2,30.2 1.2,31.4 PWR.C v2.4,32.6 | 17.6,33.4 17.2,33 v15.2,33 | v12,30.2 11.6,30.2 11.4,30 5.4,30 3,27.6 0.8,27.6 | 2.6,37.6 2.6,35.6 v1.8,34.8
  Bottom 0.254: v21.4,44.2 v18.2,41 | JP1.6 24.2,48.4 30,48.4 47,31.4 REARLED.K | v30.8,21.4 v30.8,28.6 | v24.8,21.4 v24.8,14.4 | v19.4,5.4 15.4,9.4 15.4,10 U$6.1 14.8,10.6 v12.6,10.6 | 1.8,7.4 1.8,4.2 LDR1.K | 1.8,7.4 1.8,9.6 U$8.LED2 1.6,9.8 1.6,10.4 0.6,11.4 0.6,15 v0.8,15.2 0.8,19.8 2,21 U$5.4 | v15.2,33 15.2,32.4 13,30.2 v12,30.2 | v1.8,34.8 1.8,33.2 v2.4,32.6 | 1.8,7.4 v5,7.4
  other vias: 32.75,11.25 38.75,15.75 31.75,16 8.75,12.75 3.6,9.9 4.55,11.15 5.15,12.55 2.55,15.05 5.35,14.45 21.55,23.35 4.05,25.05 8.45,29.65 6.75,36.05 6.25,39.05 38.95,32.15 37.05,32.45 35.45,30.85 36.35,24.85 22.85,45.55 25.45,42.65 30.75,41.65 31.15,39.35 34.75,37.95 26.05,31.75 23.85,34.15 17.95,31.05 8.15,19 8.55,20.45 29.45,21.45 18.8,23.3 16.6,20.9 15.5,22.2 13.8,22 13.7,25 11.5,28.2 22.75,8.25 21.55,13.95 16.85,18.9 29.75,35.45 25.85,5.55 6.5,6.45 14.5,18.8
  pour Top: -0.5,50.75 52,50.75 52,-0.5 -1,-0.5 -1,1.5
  pour Bottom: -0.5,50.5 52.25,50.5 52.25,-0.5 -2.25,-0.5 -2.25,1
N$1  (via drill 0.3)
  Top 0.254: v2.2,19.6 2.2,19.4 1.4,18.6 D13.A | v3.4,18.4 4.6,18.4 R7.1
  Bottom 0.254: v3.4,18.4 v2.2,19.6
N$2
  Top 0.254: R1.1 47.6,36.8 47.6,34.6 47,34 REARLED.A
N$3  (via drill 0.3)
  Top 0.254: v5.8,26.2 7.2,27.6 R2.2 | v5,9.6 7.8,6.8 8.2,6.8 LED1.1 | v5,44 5,42.4 5.4,42 v5.4,37.8
  Bottom 0.254: v5,9.6 3.2,11.4 3.2,14 5.8,16.6 v5.8,26.2 5.8,35.2 5.4,35.6 v5.4,37.8 | v5,44 5,46 6.6,47.6 8.2,47.6 LED2.1
N$4  (via drill 0.3)
  Top 0.254: v10.8,22.6 10,23.4 9,23.4 v8.8,23.6 7.4,25 R5.2 | v11.6,18 7.2,13.6 v5.8,13.6 | v10.6,34.8 10.6,36.2 9.2,37.6 8.8,37.6 8.2,38.2 8.2,38.6 9.4,39.8 9.4,42.2 6.2,45.4 LED2.3
  Bottom 0.254: v10.8,22.6 10.8,19.6 11.6,18.8 v11.6,18 | v5.8,13.6 5.8,4.8 6,4.6 LED1.3 | v10.6,34.8 10.6,25.4 v8.8,23.6
N$5  (via drill 0.3)
  Top 0.254: v5,20 7.2,22.2 R6.2 | v2.4,13.8 2.9,13.2 3.4,12.8 5.5,11.4 7.6,10.8 7.8,10.6 7.8,8.2 v7.6,8
  Bottom 0.254: v2.4,13.8 5,16.4 v5,20 5,32.6 0.6,37 0.6,41 2.8,43.2 6.6,43.2 LED2.4 | v7.6,8 7.6,7.6 7.2,7.2 7.2,5.2 7.4,5 7.4,3 6.8,2.4 LED1.4
N$8
  Top 0.254: PWR.A 1.4,33.6 4.6,33.6 R9.1
N$11
  Top 0.254: U3.7 20.8,34 20.8,30.6 Q1.2
N$12
  Top 0.254: U3.8 21.6,34 21.6,31.4 22.6,30.4 22.6,29.6 22,29 17.6,29 Q1.1
PD1  (via drill 0.3)
  Top 0.254: v13.6,26.4 12.4,26.4 R4.2 | v16.4,23 17.2,23 19.4,20.8 22.6,20.8 v23,21.2 | v20.6,6.2 16.6,6.2 11.4,1 6.2,1 4.2,3 4.2,7 2.8,8.4 2.8,11.2 1.8,12.2 U$8.LED1
  Bottom 0.254: v13.6,26.4 15.6,24.4 15.8,24.4 16.4,23.8 v16.4,23 | v23,21.2 23,19.4 24,18.4 24,7.6 21.8,5.4 21.4,5.4 v20.6,6.2
PD2  (via drill 0.3)
  Top 0.254: v14.2,16.4 14.2,18.2 12.4,20 R3.2 | v10.8,18.6 9.6,18.6 v9.2,19 | v3.4,27 v6.8,23.6 | v0.8,35.8 0.8,36.8 0.6,37 0.6,39.2 1.6,40.2 U$10.LED1
  Bottom 0.254: v14.2,16.4 12.2,16.4 10.8,17.8 v10.8,18.6 | v9.2,19 9.2,21.2 v6.8,23.6 | v3.4,27 3.4,30.6 0.8,33.2 v0.8,35.8
RESET  (via drill 0.3)
  Top 0.254: v13,44 13,42.8 C14.1 | v11.6,41.4 11.6,40.8 11.2,40.4 | 11.2,40.4 12.4,39.2 | 12.4,39.2 13.6,38 14.6,38 U3.29 | 11.2,40.4 R8.1 | v13.4,27.6 13.4,29 13.6,29.2 13.6,30.2 v12.8,31 | 12.4,39.2 v12.4,37 | v15.4,45.8 19.6,45.8 21.4,47.6 21.4,48.4 JP1.5
  Bottom 0.254: 13,43.4 13,42.8 v11.6,41.4 | 13,43.4 v13,44 | v13.4,27.6 10,24.2 10,12.2 12.4,9.8 12.6,9.8 18.2,4.2 18.2,3.4 RESET.P$2 | v12.8,31 12.8,31.4 11.8,32.4 11.8,34.4 12.4,35 v12.4,37 | 13,43.4 v15.4,45.8
RX  (via drill 0.3)
  Top 0.254: v17.8,37.2 14.8,37.2 U3.30 | v26.4,38.2 27.2,39 27.6,39 v30,36.6 | v35.2,34 v33.2,34 | v19.8,47 17.8,47 16.4,48.4 JP1.3
  Bottom 0.254: v17.8,37.2 18.2,37.2 19.2,38.2 v26.4,38.2 | v30,36.6 30.8,36.6 33.2,34.2 v33.2,34 | v35.2,34 34.8,34 28,40.8 26,40.8 v19.8,47
TX  (via drill 0.3)
  Top 0.254: v13.2,36.2 14.6,36.2 U3.31 | v12.6,32.6 10.2,32.6 8.8,31.2 7.6,31.2 5.8,33 5.8,34.2 v4.8,35.2
  Bottom 0.254: v13.2,36.2 13.2,34.6 12.6,34 v12.6,32.6 | v4.8,35.2 4,35.2 3.2,36 3.2,39 6.2,42 8,42 13.8,47.8 13.8,48.4 JP1.2
VCC  (via drill 0.3, 0.6)
  Top 0.254: 10.2,9.6 9.4,9.6 6.8,12.2 U$8.TR1 | 10.2,9.6 10.8,9.6 U2.1 | 10.2,9.6 11.4,8.4 12,8.4 12.6,9 12.6,9.4 U2.3 | 12.2,23.6 12.2,24.4 R4.1 | 12.2,23.6 12.2,22 R3.1 13,21.2 | 13,21.2 15.2,19 15.2,16.2 IC2.1 | v15.6,23.6 15.4,23.8 15.4,25.2 IC2.20 15.4,25.4 15.4,30.4 17.4,32.4 19,32.4 19.8,33.2 19.8,34 U3.6 | 12.2,23.6 v13.6,23.6 | v6.6,20.2 8.6,21.2 13,21.2 | U3.4 18.4,34.2 18.4,35.8 19,36.4 19.16,36.6 | 19.4,43.4 20.4,43.4 20.6,43.2 20.6,42.4 U3.18 | 19.4,43.4 19.2,43.2 19.2,42.6 U3.20 | 19.4,43.4 v19,43.8 | U$5.1 R9.2 4.8,31.4 6.8,31.4 7.6,30.6 11.4,30.6 12.6,31.8 12.8,31.8 13.4,32.4 13.4,34 | v9,38.4 11,38.4 R8.2 11,38.2 11.6,37.6 11.6,35.8 C5.1 11.8,35.6 13.4,34 | 13.4,34 v13.6,34
  Top 0.61: U3.6 20,34.13 v20,36.6 19.16,36.6 U3.20
  Top 1.016: IC2.10 v28.4,16.15 29.5,16.15 C4.1 37.4,14.52 37.4,13.9 47.5,13.9 SWIN.1 | IC2.11 28.3,25.35 v28.3,25.4
  Bottom 0.254: v13.6,23.6 v15.6,23.6 | v6.6,20.2 6.6,12.4 U$8.TR1 | v19,43.8 19,48.4 JP1.4 | v9,38.4 8.6,38.4 6.8,40.2 U$10.TR1 | v13.6,34 16.2,34 18.6,36.4 19.8,36.4 v20,36.6
  Bottom 0.61: v20,36.6 28.3,36.6 v28.3,25.4
  Bottom 1.016: v28.3,25.4 28.4,25.4 v28.4,16.15
VIN
  Top 1.016: SWIN.2 SWIN.3 47.5,23.5 CN1.1

### Text on the board
tPlace: DTR | RXD | TXD | +5V | R | GND | 5V | Ping | Echo | Gnd | ON
bPlace: Picobot v1.0 | 4tronix.co.uk / (c) 2014